# Altium schematic sheet Peripheral.SchDoc: Peripheral
size A3; Author: DO DANH LUONG; Revision: 1.0; SheetNumber: 5; SheetTotal: 6; ProjectTitle: DSP_VERSION_1.0
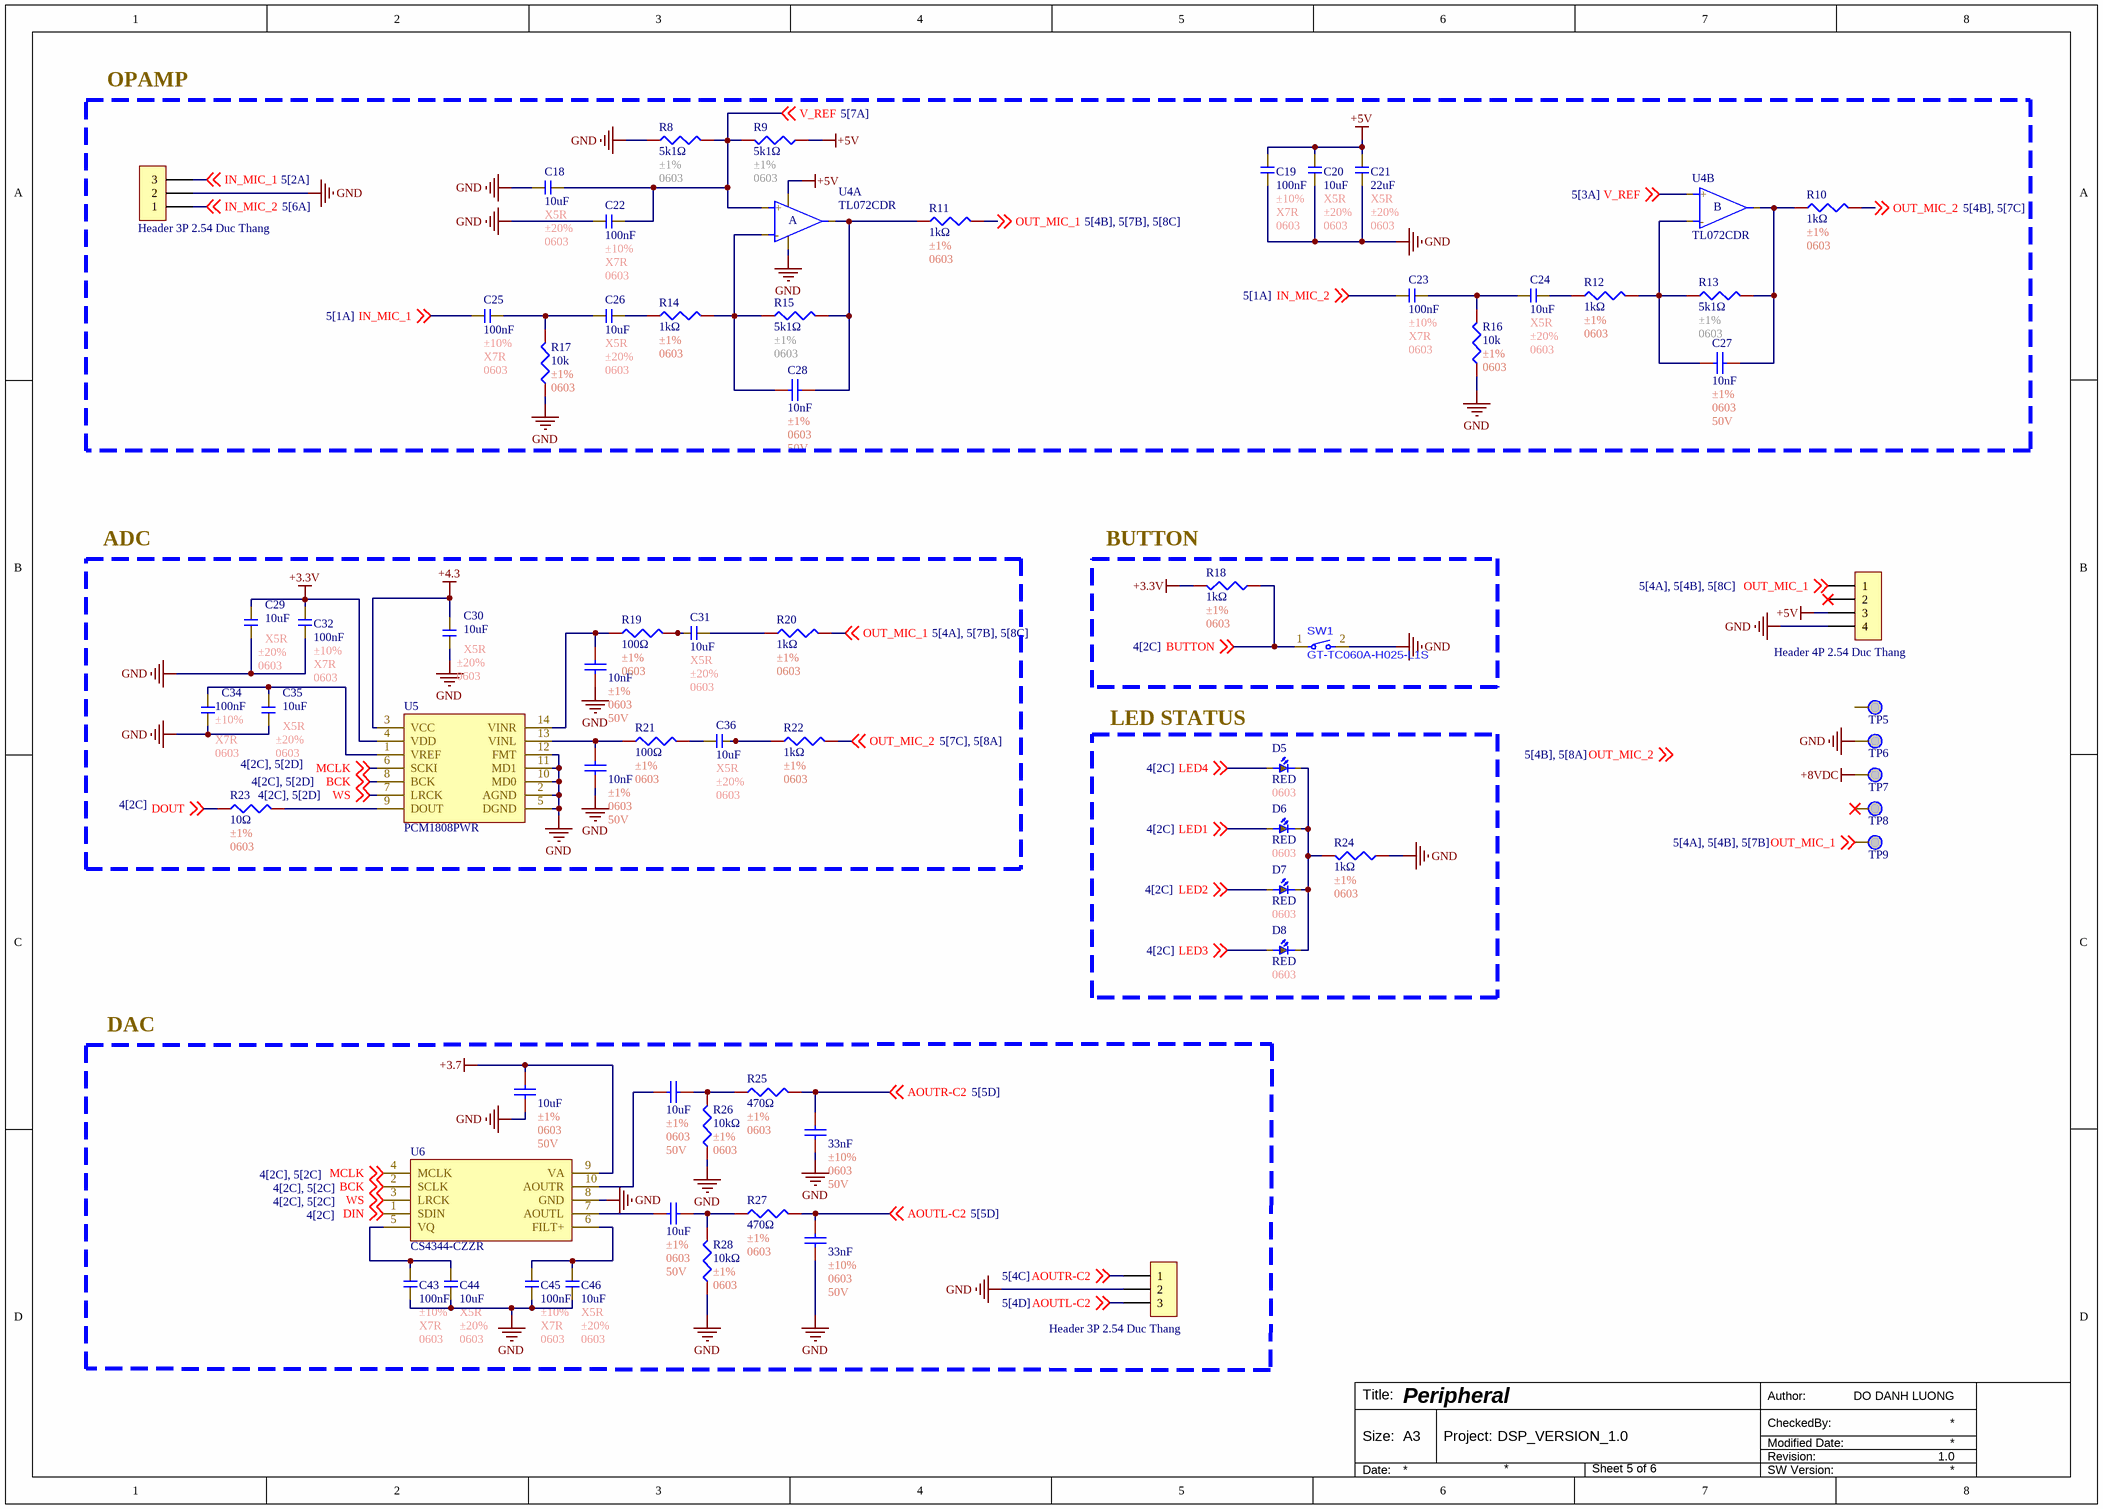
[diagram p0: Peripheral.SchDoc]

## Parts
C18  10uF  Temperature Coefficient: X5R  Tolerance: ±20%  Package: 0603  [C0603]
C19  100nF  Tolerance: ±10%  Temperature Coefficient: X7R  Package: 0603  [C0603]
C20  10uF  Temperature Coefficient: X5R  Tolerance: ±20%  Package: 0603  [C0603]
C21  22uF  Temperature Coefficient: X5R  Tolerance: ±20%  Package: 0603  [C0603]
C22  100nF  Tolerance: ±10%  Temperature Coefficient: X7R  Package: 0603  [C0603]
C23  100nF  Tolerance: ±10%  Temperature Coefficient: X7R  Package: 0603  [C0603]
C24  10uF  Temperature Coefficient: X5R  Tolerance: ±20%  Package: 0603  [C0603]
C25  100nF  Tolerance: ±10%  Temperature Coefficient: X7R  Package: 0603  [C0603]
C26  10uF  Temperature Coefficient: X5R  Tolerance: ±20%  Package: 0603  [C0603]
C27  10nF  Tolerance: ±1%  Package: 0603  Voltage Rating: 50V  [C0603]
C28  10nF  Tolerance: ±1%  Package: 0603  Voltage Rating: 50V  [C0603]
C29  10uF  Temperature Coefficient: X5R  Tolerance: ±20%  Package: 0603  [C0603]
C30  10uF  Temperature Coefficient: X5R  Tolerance: ±20%  Package: 0603  [C0603]
C31  10uF  Temperature Coefficient: X5R  Tolerance: ±20%  Package: 0603  [C0603]
C32  100nF  Tolerance: ±10%  Temperature Coefficient: X7R  Package: 0603  [C0603]
C33  10nF  Tolerance: ±1%  Package: 0603  Voltage Rating: 50V  [C0603]
C34  100nF  Tolerance: ±10%  Temperature Coefficient: X7R  Package: 0603  [C0603]
C35  10uF  Temperature Coefficient: X5R  Tolerance: ±20%  Package: 0603  [C0603]
C36  10uF  Temperature Coefficient: X5R  Tolerance: ±20%  Package: 0603  [C0603]
C37  10nF  Tolerance: ±1%  Package: 0603  Voltage Rating: 50V  [C0603]
C38  10uF  Tolerance: ±1%  Package: 0603  Voltage Rating: 50V  [C0603]
C39  10uF  Tolerance: ±1%  Package: 0603  Voltage Rating: 50V  [C0603]
C40  33nF  Tolerance: ±10%  Package: 0603  Voltage Rating: 50V  [C0603]
C41  10uF  Tolerance: ±1%  Package: 0603  Voltage Rating: 50V  [C0603]
C42  33nF  Tolerance: ±10%  Package: 0603  Voltage Rating: 50V  [C0603]
C43  100nF  Tolerance: ±10%  Temperature Coefficient: X7R  Package: 0603  [C0603]
C44  10uF  Temperature Coefficient: X5R  Tolerance: ±20%  Package: 0603  [C0603]
C45  100nF  Tolerance: ±10%  Temperature Coefficient: X7R  Package: 0603  [C0603]
C46  10uF  Temperature Coefficient: X5R  Tolerance: ±20%  Package: 0603  [C0603]
D5  RED  Package: 0603  [LED0603]
D6  RED  Package: 0603  [LED0603]
D7  RED  Package: 0603  [LED0603]
D8  RED  Package: 0603  [LED0603]
H1  Header 3P 2.54 Duc Thang  [XH2.54M-3]
H2  Header 4P 2.54 Duc Thang  [XH2.54M-4]
H3  Header 3P 2.54 Duc Thang  [XH2.54M-3]
R8  5k1Ω  Tolerance: ±1%  Package: 0603  [R0603]
R9  5k1Ω  Tolerance: ±1%  Package: 0603  [R0603]
R10  1kΩ  Tolerance: ±1%  Package: 0603  [R0603]
R11  1kΩ  Tolerance: ±1%  Package: 0603  [R0603]
R12  1kΩ  Tolerance: ±1%  Package: 0603  [R0603]
R13  5k1Ω  Tolerance: ±1%  Package: 0603  [R0603]
R14  1kΩ  Tolerance: ±1%  Package: 0603  [R0603]
R15  5k1Ω  Tolerance: ±1%  Package: 0603  [R0603]
R16  10k  Tolerance: ±1%  Package: 0603  [R0603]
R17  10k  Tolerance: ±1%  Package: 0603  [R0603]
R18  1kΩ  Tolerance: ±1%  Package: 0603  [R0603]
R19  100Ω  Tolerance: ±1%  Package: 0603  [R0603]
R20  1kΩ  Tolerance: ±1%  Package: 0603  [R0603]
R21  100Ω  Tolerance: ±1%  Package: 0603  [R0603]
R22  1kΩ  Tolerance: ±1%  Package: 0603  [R0603]
R23  10Ω  Tolerance: ±1%  Package: 0603  [R0603]
R24  1kΩ  Tolerance: ±1%  Package: 0603  [R0603]
R25  470Ω  Tolerance: ±1%  Package: 0603  [R0603]
R26  10kΩ  Tolerance: ±1%  Package: 0603  [R0603]
R27  470Ω  Tolerance: ±1%  Package: 0603  [R0603]
R28  10kΩ  Tolerance: ±1%  Package: 0603  [R0603]
SW1  GT-TC060A-H025-L1S  [GT-TC060A-H025-L1S]
TP5  TP  [TP]  (value not drawn)
TP6  TP  [TP]  (value not drawn)
TP7  TP  [TP]  (value not drawn)
TP8  TP  [TP]  (value not drawn)
TP9  TP  [TP]  (value not drawn)
U4  TL072CDR  [TL072CDR]  (parts A,B of 2)
U5  PCM1808PWR  [PCM1808PWR]
U6  CS4344-CZZR  [CS4344-CZZR]

## Blocks framed on the sheet
OPAMP: C18-C28 H1 R8-R17 U4
ADC: C29-C37 R19-R23 U5
BUTTON: R18 SW1
LED STATUS: D5-D8 R24
DAC: C38-C46 H3 R25-R28 U6

## Nets
+3.3V: C29.2 C32.2 R18.2 U5.4(VDD)
+3.7: C39.1 U6.9(VA)
+4.3: C30.2 U5.3(VCC)
+5V: C19.2 C20.2 C21.2 H2.3 R9.1 U4.8
+8VDC: TP7.1
GND: C18.2 C19.1 C20.1 C21.1 C22.2 C29.1 C30.1 C32.1 C33.2 C34.1 C35.1 C37.2 C39.2 C40.2 C42.2 C43.1 C44.1 C45.1 C46.1 H1.2 H2.4 H3.2 R8.1 R16.1 R17.1 R24.1 R26.1 R28.1 SW1.2 TP6.1 U4.4(GND) U5.2(AGND) U5.5(DGND) U5.10(MD0) U5.11(MD1) U5.12(FMT) U6.8(GND)
AOUTL-C2: C42.1 H3.3 R27.2 ; off-sheet AOUTL-C2
AOUTR-C2: C40.1 H3.1 R25.2 ; off-sheet AOUTR-C2
BCK: U5.8(BCK) U6.2(SCLK) ; off-sheet BCK
BUTTON: R18.1 SW1.1 ; off-sheet BUTTON
DIN: U6.1(SDIN) ; off-sheet DIN
DOUT: R23.1 ; off-sheet DOUT
IN_MIC_1: C25.2 H1.3 ; off-sheet IN_MIC_1
IN_MIC_2: C23.2 H1.1 ; off-sheet IN_MIC_2
LED1: D6.2 ; off-sheet LED1
LED2: D7.2 ; off-sheet LED2
LED3: D8.2 ; off-sheet LED3
LED4: D5.2 ; off-sheet LED4
MCLK: U5.6(SCKI) U6.4(MCLK) ; off-sheet MCLK
OUT_MIC_1: H2.1 R11.2 R20.2 TP9.1 ; off-sheet OUT_MIC_1
OUT_MIC_2: R10.2 R22.2 ; off-sheet OUT_MIC_2
V_REF: C18.1 C22.1 R8.2 R9.2 U4.3(+) U4.5(+) ; off-sheet V_REF
WS: U5.7(LRCK) U6.3(LRCK) ; off-sheet WS
NetC23_1: C23.1 C24.2 R16.2
NetC24_1: C24.1 R12.1
NetC25_1: C25.1 C26.2 R17.2
NetC26_1: C26.1 R14.1
NetC27_1: C27.1 R12.2 R13.1 U4.6(-)
NetC27_2: C27.2 R10.1 R13.2 U4.7(out)
NetC28_1: C28.1 R14.2 R15.1 U4.2(-)
NetC28_2: C28.2 R11.1 R15.2 U4.1(out)
NetC31_1: C31.1 R20.1
NetC31_2: C31.2 R19.2
NetC33_1: C33.1 R19.1 U5.14(VINR)
NetC34_2: C34.2 C35.2 U5.1(VREF)
NetC36_1: C36.1 R22.1
NetC36_2: C36.2 R21.2
NetC37_1: C37.1 R21.1 U5.13(VINL)
NetC38_1: C38.1 R25.1 R26.2
NetC38_2: C38.2 U6.10(AOUTR)
NetC41_1: C41.1 R27.1 R28.2
NetC41_2: C41.2 U6.7(AOUTL)
NetC43_2: C43.2 C44.2 U6.5(VQ)
NetC45_2: C45.2 C46.2 U6.6(FILT+)
NetD5_1: D5.1 D6.1 D7.1 D8.1 R24.2
NetR23_2: R23.2 U5.9(DOUT)

Not connected (* = marked no-connect by the designer): H2 2*; TP5 1; TP8 1*

## Notes on the sheet
- Labels drawn without touching a wire or pin: OUT_MIC_2
- Author:
- Title:
- Size:
- A3
- Project:
- Revision:
- Modified Date:
- CheckedBy:
- Date:
- SW Version:
- (in symbol TL072CDR, part A) A
- (in symbol TL072CDR, part B) B

## Library data of the parts
C18 C20 C24 C26 C29-C31 C35 C36 C44 C46 = C0603_10uF_±10%_X7R: 25V 10uF X5R ±20% 0603 Multilayer Ceramic Capacitors MLCC - SMD/SMT ROHS; Manufacturer: YAGEO; Mfr. Part #: CC0603MRX5R8BB106; LCSC Part #: C596327; Capacitance: 10uF; Link: https://www.lcsc.com/product-detail/C596327.html?s_z=n_capital%25200603%252010uF%2520yageo
C19 C22 C23 C25 C32 C34 C43 C45 = C0603_100nF_±10%_X7R: 50V 100nF X7R ±10% 0603 Multilayer Ceramic Capacitors MLCC - SMD/SMT ROHS; Manufacturer: YAGEO; Mfr. Part #: CC0603KRX7R9BB104; LCSC Part #: C14663; Capacitance: 100nF; Link: https://www.lcsc.com/product-detail/C14663.html?s_z=n_capital%25200603%2520100nf
C21 = C0603_22uF_±20%_X5R: 6.3V 22uF X5R ±20% 0603 Multilayer Ceramic Capacitors MLCC - SMD/SMT ROHS; Manufacturer: YAGEO; Mfr. Part #: CC0603MRX5R5BB226; LCSC Part #: C109448; ComponentLink1Description: New link; ComponentLink1URL: *; Capacitance: 22uF; Link: https://www.lcsc.com/product-detail/C109448.html?s_z=n_capital%25200603%252022uf%2520yageo
C27 C28 C33 C37 = C0603_10nF_±1%: 50V 10pF NP0 ±1% 0402 Multilayer Ceramic Capacitors MLCC - SMD/SMT ROHS; Manufacturer: YAGEO; Mfr. Part #: CC0402FRNPO9BN100; LCSC Part #: C513681; Link: https://www.lcsc.com/product-detail/C513681.html?s_z=n_capital%2520yageo%252010pF%25200402; Capacitance: 10nF
C38 C39 C41 = C0603_10uF_±1%: 50V 10pF NP0 ±1% 0402 Multilayer Ceramic Capacitors MLCC - SMD/SMT ROHS; Manufacturer: YAGEO; Mfr. Part #: CC0402FRNPO9BN100; LCSC Part #: C513681; Link: https://www.lcsc.com/product-detail/C513681.html?s_z=n_capital%2520yageo%252010pF%25200402; Capacitance: 10uF
C40 C42 = C0603_33nF_±10%: 100mW Thick Film Resistor 75V ±100ppm/℃ ±1% 470Ω 0603 Chip Resistor - Surface Mount ROHS; Manufacturer: YAGEO; Mfr. Part #: CC0603KRX7R9BB333; Temperature Coefficient: X7R; LCSC Part #: C106856; Link: https://www.lcsc.com/product-detail/C106856.html?s_z=n_capital%2520yageo%25200603%252033nF; Capacitance: 33nF
D5-D8 = D0603_RED: 25mcd~40mcd Water Clear -40℃~+85℃ 624nm Red 120° 60mW 0402 LED Indication - Discrete ROHS; Manufacturer: XINGLIGHT; Mfr. Part #: XL-1005UGC; Voltage - Forward(Vf): 3V; LCSC Part #: C965793; Power(Watts): 60mW; Link: https://www.lcsc.com/product-detail/C136765.html?s_z=n_LED%25200402%2520RED; Illumination Color: RED
H1 H3 = Header 3P 2.54 Duc Thang: Cắm; Ten_Linh_Kien: Header 3P XH2.54-3P Đực Thẳng; Don_Vi: Con; Ma_Hang: MH001292; Chung_Loai: Cắm
H2 = Header 4P 2.54 Duc Thang: Cắm; Ten_Linh_Kien: Header 4P XH2.54-4P Đực Thẳng; Don_Vi: Con; Ma_Hang: MH001285; Chung_Loai: Cắm
R8 R9 R13 R15 = R0603_5k1Ω_±1%: 100mW Thick Film Resistor 75V ±100ppm/℃ ±1% 5.1kΩ 0603 Chip Resistor - Surface Mount ROHS; Manufacturer: FOJAN; Mfr. Part #: FRC0603F5101TS; Key Attributes: RES 5.1kΩ ±1% 100mW 0603; LCSC Part #: C2907044; Link: https://www.lcsc.com/product-detail/C2907044.html?s_z=n_5k1%25200603; Resistance: 5k1Ω
R10-R12 R14 R18 R20 R22 R24 = R0603_1kΩ_±1%: 62.5mW Thick Film Resistor 50V ±1% ±200ppm/℃ 10Ω 0402 Chip Resistor - Surface Mount ROHS; Manufacturer: YAGEO; Mfr. Part #: RC0402FR-0710RL; LCSC Part #: C138066; Resistance: 1kΩ; Link: https://www.lcsc.com/product-detail/C138066.html?s_z=n_resistor%25200402%252010R
R16 R17 = R0603_1kΩ_±1%: 62.5mW Thick Film Resistor 50V ±1% ±200ppm/℃ 10Ω 0402 Chip Resistor - Surface Mount ROHS; Manufacturer: YAGEO; Mfr. Part #: RC0402FR-0710RL; Resistance: 1kΩ; LCSC Part #: C138066; Link: https://www.lcsc.com/product-detail/C138066.html?s_z=n_resistor%25200402%252010R
R19 R21 = R0603_100Ω_±1%: 62.5mW Thick Film Resistor 50V ±1% ±200ppm/℃ 10Ω 0402 Chip Resistor - Surface Mount ROHS; Manufacturer: YAGEO; Mfr. Part #: RC0402FR-0710RL; LCSC Part #: C138066; Resistance: 100Ω; Link: https://www.lcsc.com/product-detail/C138066.html?s_z=n_resistor%25200402%252010R
R23 = R0603_10Ω_±1%: 62.5mW Thick Film Resistor 50V ±1% ±200ppm/℃ 10Ω 0402 Chip Resistor - Surface Mount ROHS; Manufacturer: YAGEO; Mfr. Part #: RC0402FR-0710RL; LCSC Part #: C138066; Resistance: 10Ω; Link: https://www.lcsc.com/product-detail/C138066.html?s_z=n_resistor%25200402%252010R
R25 R27 = R0603_470Ω_±1%_1: 62.5mW Thick Film Resistor 50V ±1% ±200ppm/℃ 10Ω 0402 Chip Resistor - Surface Mount ROHS; Manufacturer: YAGEO; Mfr. Part #: RC0603FR-07470RL; Key Attributes: RES 470Ω ±1% 100mW 0603; LCSC Part #: C114669; Resistance: 470Ω; Link: https://www.lcsc.com/product-detail/C114669.html?s_z=n_resistor%2520470%25CE%25A9%25200603%2520yageo
R26 R28 = R0603_10kΩ_±1%: 62.5mW Thick Film Resistor 50V ±1% ±200ppm/℃ 10Ω 0402 Chip Resistor - Surface Mount ROHS; Manufacturer: YAGEO; Mfr. Part #: RC0402FR-0710RL; LCSC Part #: C138066; Resistance: 10kΩ; Link: https://www.lcsc.com/product-detail/C138066.html?s_z=n_resistor%25200402%252010R
SW1 = GT-TC060A-H025-L1S: Tactile Switch SPST 160gf 2.5mm SMD (SMT) Tab 6.05mm x 3.5mm Surface Mount; Manufacturer: G-Switch; Key Attributes: SWITCH TACTILE SPST 160gf SMD; Mfr. Part #: GT-TC060A-H025-L1S; LCSC Part #: C7450623; Package: SMD,6x3mm; Link: https://www.lcsc.com/product-detail/C7450623.html?s_z=n_button
U4 = TL072CDR: 3mV 65pA 3MHz 13V/us 2 SOIC-8 FET Input Amplifiers ROHS; Manufacturer: TI; Noise density(eN): 18nV/√Hz@1kHz; Dual Supply: -15V~15V; Number of Channels: 2; LCSC Part #: C67473; Package: SOIC-8; Gain Bandwidth Product: 3MHz; Link: https://www.lcsc.com/product-detail/C67473.html?s_z=n_TL072CDR; Mfr. Part #: TL072CDR
U5 = PCM1808PWR: 4.5V~5.5V 24 I2S TSSOP-14 ADCs/DACs - Special Purpose ROHS; Manufacturer: TI; Key Attributes: Single-ended analog input 24-bit 96kHz stereo A/D converter; Number of Channels: 2; Mfr. Part #: PCM1808PWR; LCSC Part #: C55513; Package: TSSOP-14; Voltage - Supply: 4.5V~5.5V; Interface: I2S; Link: https://www.lcsc.com/product-detail/C55513.html?s_z=n_pcm1808
U6 = CS4344-CZZR: 250ms I2S 3.3V~5V 24 TSSOP-10-3mm Digital to Analog Converters (DAC) ROHS; Manufacturer: Cirrus Logic; Key Attributes: 10-Pin, 24-Bit, 192 kHz Stereo D/A Converter; Number of Channels: 2; Mfr. Part #: CS4344-CZZR; LCSC Part #: C8952; Package: TSSOP-10-3mm; Link: https://www.lcsc.com/product-detail/C8952.html?s_z=n_cs4344; Voltage - Supply: 3.3V~5V; Interface: I2S